# Altium schematic sheet top.SchDoc
size A
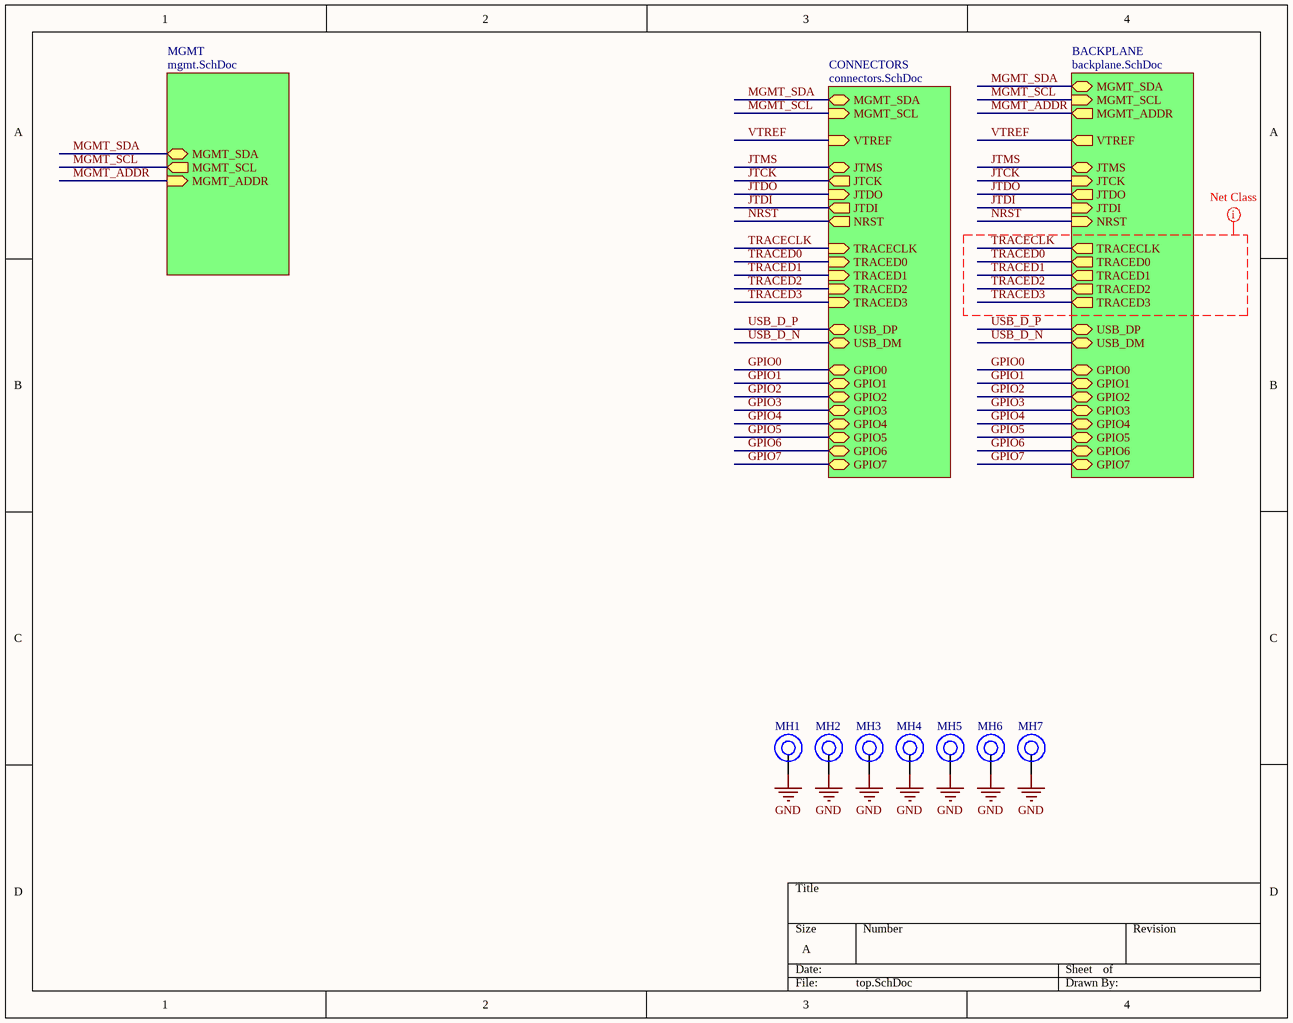
[diagram p0: top.SchDoc]

## Parts
MH1  Mounting_Hole  [WA-SMSI_M2.5]  (value not drawn)
MH2  Mounting_Hole  [WA-SMSI_M2.5]  (value not drawn)
MH3  Mounting_Hole  [WA-SMSI_M2.5]  (value not drawn)
MH4  Mounting_Hole  [WA-SMSI_M2.5]  (value not drawn)
MH5  Mounting_Hole  [WA-SMSI_M2.5]  (value not drawn)
MH6  Mounting_Hole  [WA-SMSI_M2.5]  (value not drawn)
MH7  Mounting_Hole  [WA-SMSI_M2.5]  (value not drawn)

## Sub-sheets
BACKPLANE = backplane.SchDoc: JTCK (in), GPIO1 (bidir), GPIO0 (bidir), TRACED0 (out), GPIO6 (bidir), USB_DP (bidir), NRST (in), USB_DM (bidir), MGMT_SDA (bidir), GPIO5 (bidir), JTDO (out), GPIO7 (bidir), GPIO3 (bidir), VTREF (out), TRACED2 (out), GPIO2 (bidir), TRACECLK (out), GPIO4 (bidir), MGMT_SCL (in), JTMS (bidir), TRACED3 (out), TRACED1 (out), JTDI (in), MGMT_ADDR (out)
CONNECTORS = connectors.SchDoc: JTCK (out), GPIO1 (bidir), GPIO0 (bidir), TRACED0 (in), GPIO6 (bidir), USB_DP (bidir), NRST (out), USB_DM (bidir), MGMT_SDA (bidir), GPIO5 (bidir), JTDO (in), GPIO7 (bidir), GPIO3 (bidir), VTREF (in), TRACED2 (in), GPIO2 (bidir), TRACECLK (in), GPIO4 (bidir), MGMT_SCL (in), JTMS (bidir), TRACED3 (in), TRACED1 (in), JTDI (out)
MGMT = mgmt.SchDoc: MGMT_SDA (bidir), MGMT_SCL (out), MGMT_ADDR (in)

## Nets
GND: MH1.1 MH2.1 MH3.1 MH4.1 MH5.1 MH6.1 MH7.1
GPIO0: sheet BACKPLANE/GPIO0, sheet CONNECTORS/GPIO0
GPIO1: sheet BACKPLANE/GPIO1, sheet CONNECTORS/GPIO1
GPIO2: sheet BACKPLANE/GPIO2, sheet CONNECTORS/GPIO2
GPIO3: sheet BACKPLANE/GPIO3, sheet CONNECTORS/GPIO3
GPIO4: sheet BACKPLANE/GPIO4, sheet CONNECTORS/GPIO4
GPIO5: sheet BACKPLANE/GPIO5, sheet CONNECTORS/GPIO5
GPIO6: sheet BACKPLANE/GPIO6, sheet CONNECTORS/GPIO6
GPIO7: sheet BACKPLANE/GPIO7, sheet CONNECTORS/GPIO7
JTCK: sheet BACKPLANE/JTCK, sheet CONNECTORS/JTCK
JTDI: sheet BACKPLANE/JTDI, sheet CONNECTORS/JTDI
JTDO: sheet BACKPLANE/JTDO, sheet CONNECTORS/JTDO
JTMS: sheet BACKPLANE/JTMS, sheet CONNECTORS/JTMS
MGMT_ADDR: sheet BACKPLANE/MGMT_ADDR, sheet MGMT/MGMT_ADDR
MGMT_SCL: sheet BACKPLANE/MGMT_SCL, sheet MGMT/MGMT_SCL, sheet CONNECTORS/MGMT_SCL
MGMT_SDA: sheet BACKPLANE/MGMT_SDA, sheet MGMT/MGMT_SDA, sheet CONNECTORS/MGMT_SDA
NRST: sheet BACKPLANE/NRST, sheet CONNECTORS/NRST
TRACECLK: sheet BACKPLANE/TRACECLK, sheet CONNECTORS/TRACECLK
TRACED0: sheet BACKPLANE/TRACED0, sheet CONNECTORS/TRACED0
TRACED1: sheet BACKPLANE/TRACED1, sheet CONNECTORS/TRACED1
TRACED2: sheet BACKPLANE/TRACED2, sheet CONNECTORS/TRACED2
TRACED3: sheet BACKPLANE/TRACED3, sheet CONNECTORS/TRACED3
USB_D_N: sheet BACKPLANE/USB_DM, sheet CONNECTORS/USB_DM
USB_D_P: sheet BACKPLANE/USB_DP, sheet CONNECTORS/USB_DP
VTREF: sheet BACKPLANE/VTREF, sheet CONNECTORS/VTREF

## Layout directives
net class TRACE: TRACECLK, TRACED0, TRACED1, TRACED2, TRACED3